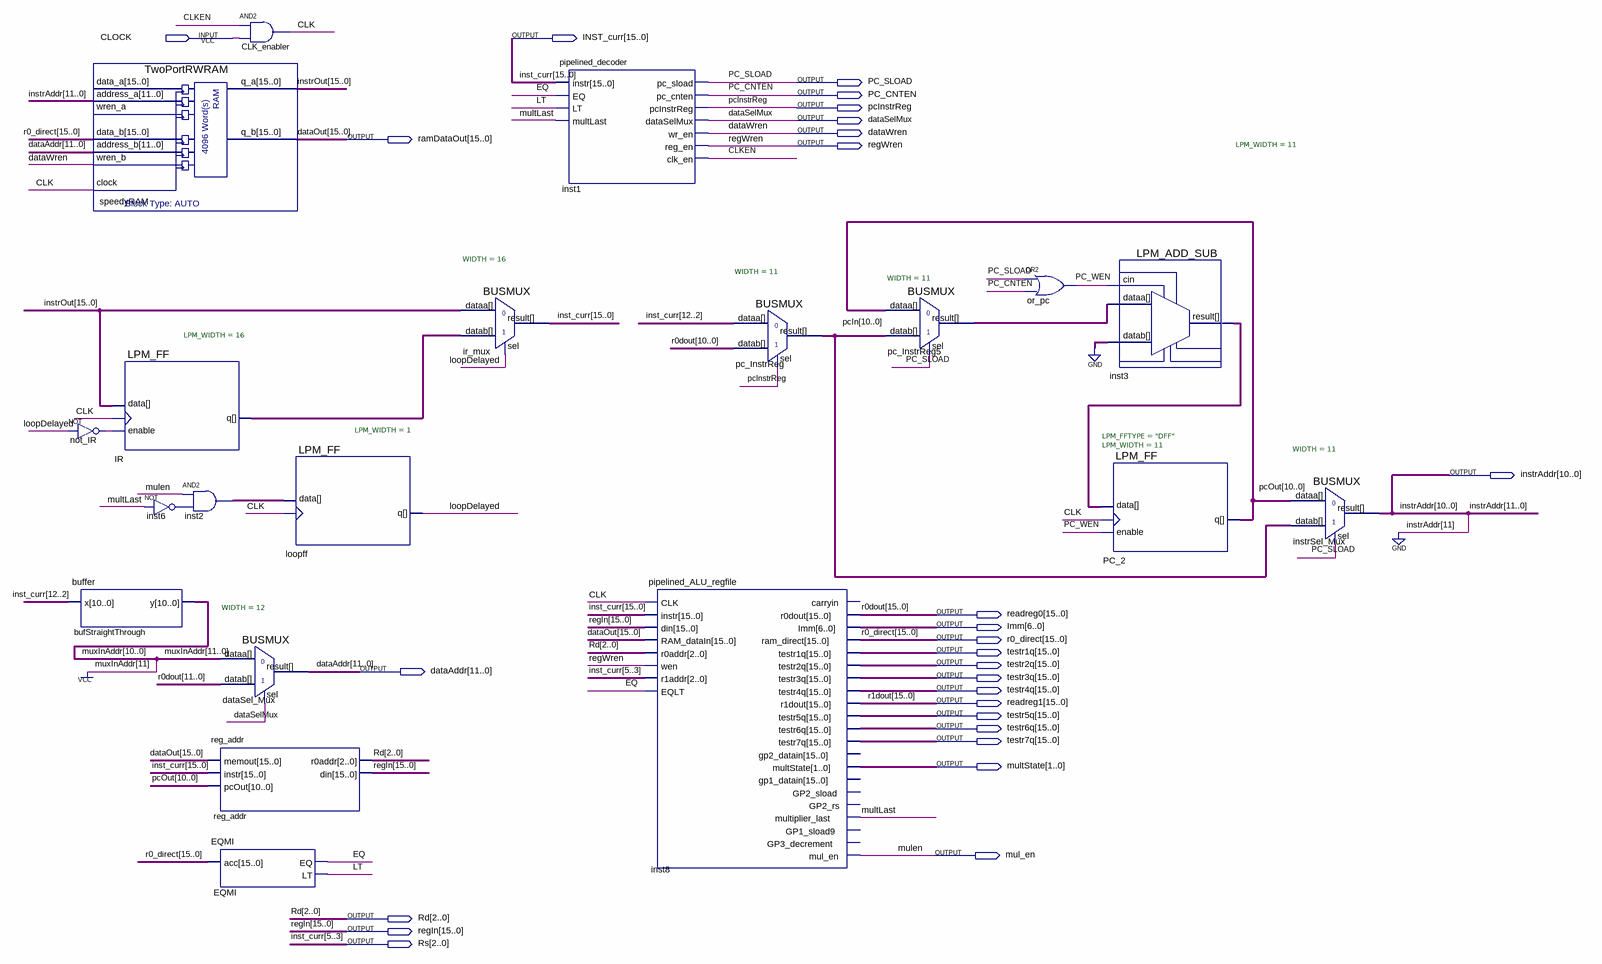
[diagram p0: schematic sheet]
// Quartus schematic lma0_v4_pipelined.bdf as structural Verilog: 20 symbols, 27 pins
module lma0_v4_pipelined (
  input  CLOCK,
  output [15:0] INST_curr,
  output PC_SLOAD,
  output PC_CNTEN,
  output pcInstrReg,
  output dataSelMux,
  output dataWren,
  output [15:0] ramDataOut,
  output regWren,
  output [10:0] instrAddr,
  output [15:0] readreg0,
  output [6:0] Imm,
  output [15:0] r0_direct,
  output [15:0] testr1q,
  output [15:0] testr2q,
  output [11:0] dataAddr,
  output [15:0] testr3q,
  output [15:0] testr4q,
  output [15:0] readreg1,
  output [15:0] testr5q,
  output [15:0] testr6q,
  output [15:0] testr7q,
  output [1:0] multState,
  output mul_en,
  output [2:0] Rd,
  output [15:0] regIn,
  output [2:0] Rs
);

  wire CLK, CLKEN, EQ, inst2_out, inst6_out, loopDelayed, LT, multLast, not_IR_out, PC_WEN;
  wire [10:0] inst3_result, muxInAddr, pc_InstrReg5_result, pcIn, pcOut;
  wire [15:0] instrOut, IR_q;

  not not_IR (not_IR_out, loopDelayed);
  buffer bufStraightThrough (.x(INST_curr[12:2]), .y(muxInAddr));
  TwoPortRWRAM speedyRAM (
    .address_a({1'b0, instrAddr}), .data_b(r0_direct), .address_b(dataAddr), .wren_b(dataWren), .clock(CLK),
    .q_a(instrOut), .q_b(ramDataOut));  // open: data_a, wren_a
  LPM_FF #(.LPM_WIDTH(16)) IR (.enable(not_IR_out), .clock(CLK), .data(instrOut), .q(IR_q));
  not inst6 (inst6_out, multLast);
  and inst2 (inst2_out, mul_en, inst6_out);
  BUSMUX #(.WIDTH(12)) dataSel_Mux (
    .datab(readreg0[11:0]), .sel(dataSelMux), .dataa({1'b1, muxInAddr}), .result(dataAddr));
  reg_addr reg_addr (.memout(ramDataOut), .instr(INST_curr), .pcOut(pcOut), .r0addr(Rd), .din(regIn));
  EQMI EQMI (.acc(r0_direct), .EQ(EQ), .LT(LT));
  and CLK_enabler (CLK, CLKEN, CLOCK);
  LPM_FF #(.LPM_WIDTH(1)) loopff (.clock(CLK), .data(inst2_out), .q(loopDelayed));
  BUSMUX #(.WIDTH(16)) ir_mux (.datab(IR_q), .sel(loopDelayed), .dataa(instrOut), .result(INST_curr));
  pipelined_decoder inst1 (
    .instr(INST_curr), .EQ(EQ), .LT(LT), .multLast(multLast), .pc_sload(PC_SLOAD), .pc_cnten(PC_CNTEN),
    .pcInstrReg(pcInstrReg), .dataSelMux(dataSelMux), .wr_en(dataWren), .reg_en(regWren), .clk_en(CLKEN));
  pipelined_ALU_regfile inst8 (
    .CLK(CLK), .instr(INST_curr), .din(regIn), .RAM_dataIn(ramDataOut), .r0addr(Rd), .wen(regWren),
    .r1addr(INST_curr[5:3]), .EQLT(EQ), .r0dout(readreg0), .Imm(Imm), .ram_direct(r0_direct),
    .testr1q(testr1q), .testr2q(testr2q), .testr3q(testr3q), .testr4q(testr4q), .r1dout(readreg1),
    .testr5q(testr5q), .testr6q(testr6q), .testr7q(testr7q), .multState(multState),
    .multiplier_last(multLast), .mul_en(mul_en));  // open: carryin, gp2_datain, gp1_datain, GP2_sload, GP2_rs, GP1_sload9, GP3_decrement
  BUSMUX #(.WIDTH(11)) pc_InstrReg (.datab(readreg0[10:0]), .sel(pcInstrReg), .dataa(INST_curr[12:2]), .result(pcIn));
  BUSMUX #(.WIDTH(11)) pc_InstrReg5 (.datab(pcIn), .sel(PC_SLOAD), .dataa(pcOut), .result(pc_InstrReg5_result));
  or or_pc (PC_WEN, PC_SLOAD, PC_CNTEN);
  LPM_ADD_SUB #(.LPM_WIDTH(11)) inst3 (
    .cin(PC_WEN), .dataa(pc_InstrReg5_result), .datab({11{1'b0}}), .result(inst3_result));
  LPM_FF #(.LPM_FFTYPE("DFF"), .LPM_WIDTH(11)) PC_2 (.clock(CLK), .data(inst3_result), .enable(PC_WEN), .q(pcOut));
  BUSMUX #(.WIDTH(11)) instrSel_Mux (.datab(pcIn), .sel(PC_SLOAD), .dataa(pcOut), .result(instrAddr));

  assign Rs = INST_curr[5:3];

  // Other names for the same wires on the sheet: dataOut[15:0] = ramDataOut; mulen = mul_en; r0dout[15:0] = readreg0;
  //   r1dout[15:0] = readreg1
endmodule
